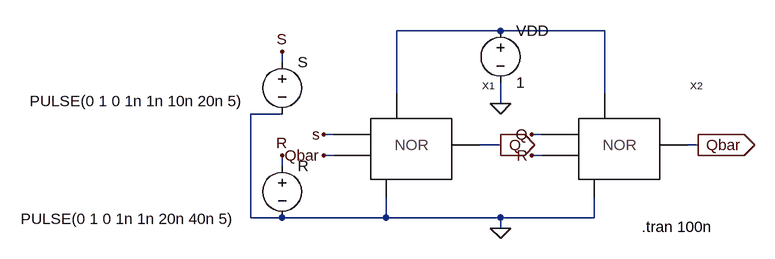
[diagram p0: schematic SR-LATCH.asc]
SR-LATCH.asc, the LTspice schematic file:
Version 4.1
SHEET 1 880 680
WIRE 256 -48 96 -48
WIRE 416 -48 256 -48
WIRE -80 0 -80 -16
WIRE 96 48 96 -48
WIRE 416 48 416 -48
WIRE 256 64 256 32
WIRE -80 80 -128 80
WIRE 0 112 -16 112
WIRE 320 112 304 112
WIRE 256 128 224 128
WIRE 560 128 544 128
WIRE 0 144 -16 144
WIRE 320 144 304 144
WIRE -80 160 -80 144
WIRE -128 240 -128 80
WIRE -80 240 -128 240
WIRE 80 240 80 208
WIRE 80 240 -80 240
WIRE 256 240 80 240
WIRE 400 240 400 208
WIRE 400 240 256 240
WIRE 256 256 256 240
FLAG 256 256 0
FLAG 256 64 0
FLAG 256 128 Q
IOPIN 256 128 Out
FLAG 560 128 Qbar
IOPIN 560 128 Out
FLAG 304 112 Q
FLAG -80 -16 S
FLAG -16 112 s
FLAG -16 144 Qbar
FLAG -80 144 R
FLAG 304 144 R
SYMBOL Nor-Curcuit 112 128 R0
SYMATTR InstName X1
SYMBOL Nor-Curcuit 432 128 R0
SYMATTR InstName X2
SYMBOL voltage -80 -16 R0
WINDOW 3 -388 76 Left 2
WINDOW 123 0 0 Left 0
WINDOW 39 0 0 Left 0
SYMATTR InstName S
SYMATTR Value PULSE(0 1 0 1n 1n 10n 20n 5)
SYMBOL voltage -80 144 R0
WINDOW 3 -402 98 Left 2
WINDOW 123 0 0 Left 0
WINDOW 39 0 0 Left 0
SYMATTR InstName R
SYMATTR Value PULSE(0 1 0 1n 1n 20n 40n 5)
SYMBOL voltage 256 -64 R0
SYMATTR InstName VDD
SYMATTR Value 1
TEXT 473 254 Left 2 !.tran 100n

The netlist it stands for:
* SR-LATCH.asc
X§X1 S Qbar 0 Q N001 Nor-Curcuit  ; pins A B VG Vout VDD
X§X2 Q R 0 Qbar N001 Nor-Curcuit  ; pins A B VG Vout VDD
V§S S 0 PULSE(0 1 0 1n 1n 10n 20n 5)
V§R R 0 PULSE(0 1 0 1n 1n 20n 40n 5)
VDD N001 0 1
.tran 100n
.backanno
.end